# Altium project DPS-300.PrjPcb
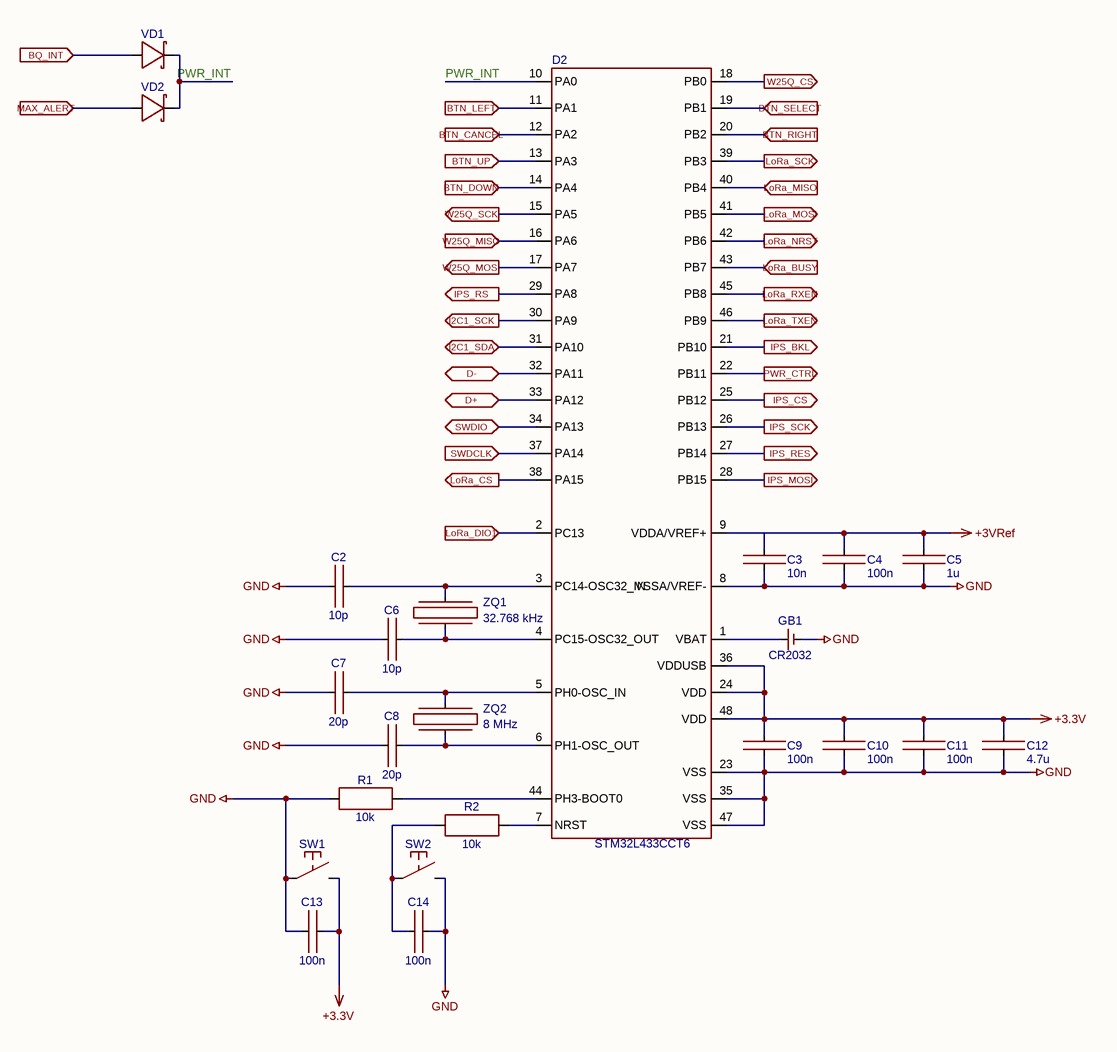
[diagram p0: MCU.SchDoc]
8 sheets, 76 parts. Net scope: flat (ports and power ports of the same name join across sheets).
Board file: DPS-300.PcbDoc
Sheets:
  MCU.SchDoc
  Power.SchDoc
  USB.SchDoc
  Connectors.SchDoc
  LoRa.SchDoc
  Display.SchDoc
  Keyboard.SchDoc
  Flash.SchDoc

## Sheet MCU.SchDoc
size A3; SheetNumber: 1; SheetTotal: 8

### Parts
C2  10p  [CAPC1608X09N]
C3  10n  [CAPC1608X09N]
C4  100n  [CAPC1608X09N]
C5  1u  [CAPC1608X09N]
C6  10p  [CAPC1608X09N]
C7  20p  [CAPC1608X09N]
C8  20p  [CAPC1608X09N]
C9  100n  [CAPC1608X09N]
C10  100n  [CAPC1608X09N]
C11  100n  [CAPC1608X09N]
C12  4.7u  [CAPC1608X09N]
C13  100n  [CAPC1608X09N]
C14  100n  [CAPC1608X09N]
D2  STM32L433CCT6  [STM LQFP-48 (5B_ME_V2)]
GB1  CR2032  [KLS5-CR2032-03]
R1  10k  [RESC2012X05N]
R2  10k  [RESC2012X05N]
SW1  FSM1SM  [FSM1SM]  (value not drawn)
SW2  FSM1SM  [FSM1SM]  (value not drawn)
VD1  BAR6402VH6327XTSA1  [INFENION SC79]  (value not drawn)
VD2  BAR6402VH6327XTSA1  [INFENION SC79]  (value not drawn)
ZQ1  32.768 kHz  [NX3215SA]
ZQ2  8 МHz  [NX5032GA]

### Ports
BQ_INT (in), BTN_CANCEL (in), BTN_DOWN (in), BTN_LEFT (in), BTN_RIGHT (in), BTN_SELECT (in), BTN_UP (in), D+ (bidir), D- (bidir), I2C1_SCK (out), I2C1_SDA (bidir), IPS_BKL (out), IPS_CS (out), IPS_MOSI (out), IPS_RES (out), IPS_RS (out), IPS_SCK (out), LoRa_BUSY (in), LoRa_CS (out), LoRa_DIO1 (in), LoRa_MISO (in), LoRa_MOSI (out), LoRa_NRST (out), LoRa_RXEN (out), LoRa_SCK (out), LoRa_TXEN (out), MAX_ALERT (in), PWR_CTRL (out), SWDCLK (in), SWDIO (bidir), W25Q_CS (out), W25Q_MISO (in), W25Q_MOSI (out), W25Q_SCK (out)

### Nets
+3.3V: C9.2 C10.2 C11.2 C12.2 C13.2 D2.24(VDD) D2.36(VDDUSB) D2.48(VDD) SW1.1
+3VRef: C3.2 C4.2 C5.2 D2.9(VDDA/VREF+)
GND: C2.1 C3.1 C4.1 C5.1 C6.1 C7.1 C8.1 C9.1 C10.1 C11.1 C12.1 C13.1 C14.2 D2.8(VSSA/VREF-) D2.23(VSS) D2.35(VSS) D2.47(VSS) GB1.0 R1.1 SW1.0 SW2.1
BQ_INT: VD1.2 ; port BQ_INT
BTN_CANCEL: D2.12(PA2) ; port BTN_CANCEL
BTN_DOWN: D2.14(PA4) ; port BTN_DOWN
BTN_LEFT: D2.11(PA1) ; port BTN_LEFT
BTN_RIGHT: D2.20(PB2) ; port BTN_RIGHT
BTN_SELECT: D2.19(PB1) ; port BTN_SELECT
BTN_UP: D2.13(PA3) ; port BTN_UP
D+: D2.33(PA12) ; port D+
D-: D2.32(PA11) ; port D-
I2C1_SCK: D2.30(PA9) ; port I2C1_SCK
I2C1_SDA: D2.31(PA10) ; port I2C1_SDA
IPS_BKL: D2.21(PB10) ; port IPS_BKL
IPS_CS: D2.25(PB12) ; port IPS_CS
IPS_MOSI: D2.28(PB15) ; port IPS_MOSI
IPS_RES: D2.27(PB14) ; port IPS_RES
IPS_RS: D2.29(PA8) ; port IPS_RS
IPS_SCK: D2.26(PB13) ; port IPS_SCK
LoRa_BUSY: D2.43(PB7) ; port LoRa_BUSY
LoRa_CS: D2.38(PA15) ; port LoRa_CS
LoRa_DIO1: D2.2(PC13) ; port LoRa_DIO1
LoRa_MISO: D2.40(PB4) ; port LoRa_MISO
LoRa_MOSI: D2.41(PB5) ; port LoRa_MOSI
LoRa_NRST: D2.42(PB6) ; port LoRa_NRST
LoRa_RXEN: D2.45(PB8) ; port LoRa_RXEN
LoRa_SCK: D2.39(PB3) ; port LoRa_SCK
LoRa_TXEN: D2.46(PB9) ; port LoRa_TXEN
MAX_ALERT: VD2.2 ; port MAX_ALERT
PWR_CTRL: D2.22(PB11) ; port PWR_CTRL
PWR_INT: D2.10(PA0) VD1.1 VD2.1
SWDCLK: D2.37(PA14) ; port SWDCLK
SWDIO: D2.34(PA13) ; port SWDIO
W25Q_CS: D2.18(PB0) ; port W25Q_CS
W25Q_MISO: D2.16(PA6) ; port W25Q_MISO
W25Q_MOSI: D2.17(PA7) ; port W25Q_MOSI
W25Q_SCK: D2.15(PA5) ; port W25Q_SCK
NetC2_2: C2.2 D2.3(PC14-OSC32_IN) ZQ1.1
NetC6_2: C6.2 D2.4(PC15-OSC32_OUT) ZQ1.0
NetC7_2: C7.2 D2.5(PH0-OSC_IN) ZQ2.1
NetC8_2: C8.2 D2.6(PH1-OSC_OUT) ZQ2.0
NetC14_1: C14.1 R2.1 SW2.0
NetD2_1: D2.1(VBAT) GB1.1
NetD2_7: D2.7(NRST) R2.2
NetD2_44: D2.44(PH3-BOOT0) R1.2

### Library data of the parts
C2 C6 = C0603-10p-50V-NPO-5%: GRM1885C1H100JA01D
C3 = C0603-10n-100V-X7R-10%: GRM188R72A103KA01D
C4 C9-C11 C13 C14 = C0603-100n-25V-X7R-10%: GRM188R71E104KA01D
C5 = C0603-1u-25V-X7R-10%: GRM188R71E105KA12D
C7 C8 = C0603-20p-50V-NPO-5%: GRM1885C1H200J
C12 = C0603-4.7u-10V-X5R-10%: GRM188R61A475K
GB1 = KLS5-CR2032-03
R1 R2 = R-0805-10k-5%
SW1 SW2 = FSM1SM: 1437566-3 (FSMSM), Кнопка тактовая h=4.6 мм SMD SPST
ZQ1 = NX3215SA: 32.768 кГц, 20ppm, 7пФ, 70кОм, -40...+85°C, SMD 3.2*1.5*0.8мм, Кварцевый резонатор
ZQ2 = NX5032GA: 8 МГц, 30/20ppm, 8пФ, -40...+85°C, SMD 5.0*3.2*1.3мм, Кварцевый резонатор

## Sheet Power.SchDoc
size A4; SheetNumber: 2; SheetTotal: 8
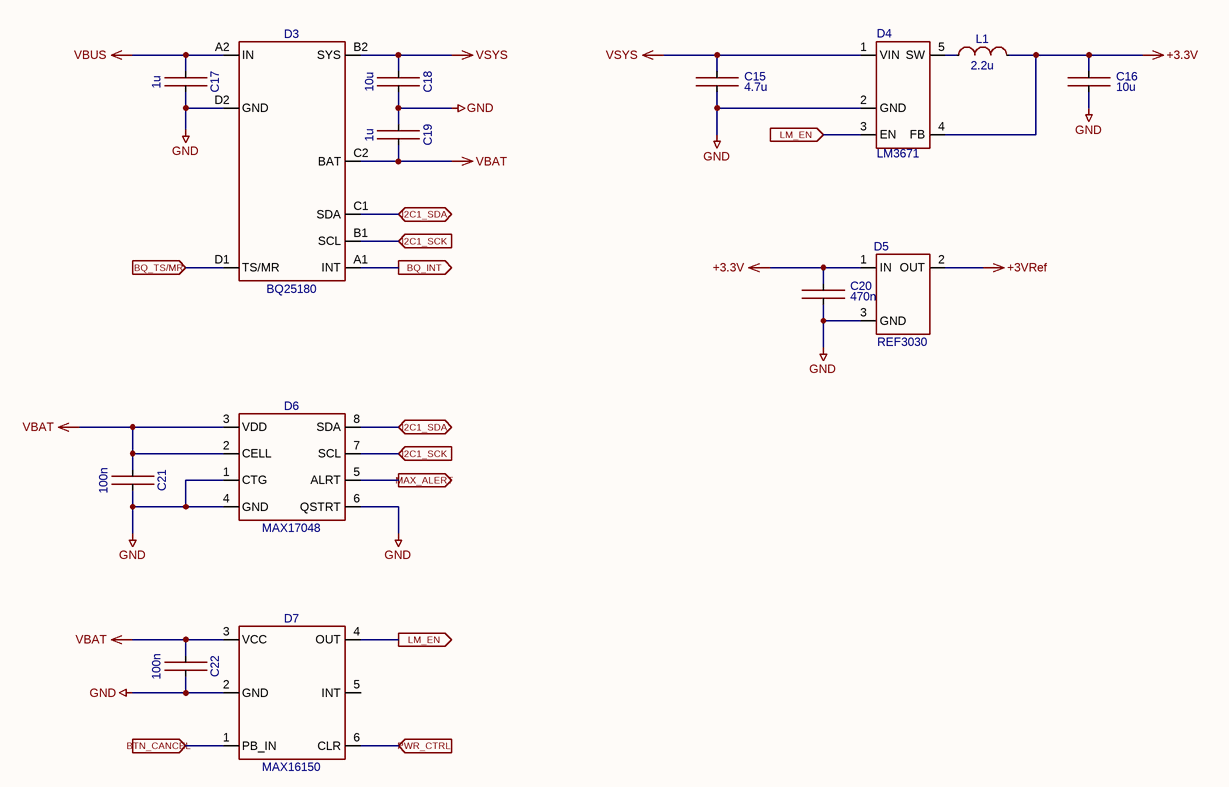
[diagram p1: Power.SchDoc]

### Parts
C15  4.7u  [CAPC1608X09N]
C16  10u  [CAPC1608X09N]
C17  1u  [CAPC1608X09N]
C18  10u  [CAPC1608X09N]
C19  1u  [CAPC1608X09N]
C20  470n  [CAPC1608X09N]
C21  100n  [CAPC1608X09N]
C22  100n  [CAPC1608X09N]
D3  BQ25180  [TI DSBGA (YBG0008)]
D4  LM3671  [TI DBV (R-PDSO-G5)]
D5  REF3030  [TI DBZ (R-PDSO-G3)]
D6  MAX17048  [MAXIM 8 TDFN-EP (T822-3)]
D7  MAX16150  [MAXIM WLP6 (21-0058)]
L1  2.2u  [Murata LQH43CN]

### Ports
BQ_INT (out), BQ_TS/MR (in), BTN_CANCEL (in), I2C1_SCK (in), I2C1_SDA (bidir), LM_EN (in), LM_EN (out), MAX_ALERT (out), PWR_CTRL (in)

### Nets
+3.3V: C16.2 C20.2 D4.4(FB) D5.1(IN) L1.2
+3VRef: D5.2(OUT)
GND: C15.1 C16.1 C17.2 C18.2 C19.1 C20.1 C21.2 C22.2 D3.D2(GND) D4.2(GND) D5.3(GND) D6.1(CTG) D6.4(GND) D6.6(QSTRT) D7.2(GND)
VBAT: C19.2 C21.1 C22.1 D3.C2(BAT) D6.2(CELL) D6.3(VDD) D7.3(VCC)
VBUS: C17.1 D3.A2(IN)
VSYS: C15.2 C18.1 D3.B2(SYS) D4.1(VIN)
BQ_INT: D3.A1(INT) ; port BQ_INT
BQ_TS/MR: D3.D1(TS/MR) ; port BQ_TS/MR
BTN_CANCEL: D7.1(PB_IN) ; port BTN_CANCEL
I2C1_SCK: D3.B1(SCL) D6.7(SCL) ; port I2C1_SCK
I2C1_SDA: D3.C1(SDA) D6.8(SDA) ; port I2C1_SDA
LM_EN: D4.3(EN) D7.4(OUT) ; port LM_EN
MAX_ALERT: D6.5(ALRT) ; port MAX_ALERT
PWR_CTRL: D7.6(CLR) ; port PWR_CTRL
NetD4_5: D4.5(SW) L1.1

Not connected (* = marked no-connect by the designer): D7 5(INT)

### Library data of the parts
C15 = C0603-4.7u-10V-X5R-10%: GRM188R61A475K
C16 C18 = C0603-10u-6.3V-X5R-20%: GRM188R60J106ME47D
C17 C19 = C0603-1u-25V-X7R-10%: GRM188R71E105KA12D
C20 = C0603-470n-16V-X7R-10%: GRM188R71C474KA88D
C21 C22 = C0603-100n-25V-X7R-10%: GRM188R71E104KA01D
D3 = BQ25180YBGR: 1-A Li-ion I²C programmable charger with regulated power path in WCSP package
D4 = LM3671MF-3.3/NOPB
D5 = REF3030AIDBZT
D6 = MAX17048G
D7 = MAX16150A
L1 = L1812-2.2u-0.9A-20%: LQH43CN2R2M03L

## Sheet USB.SchDoc
size A4; SheetNumber: 3; SheetTotal: 8
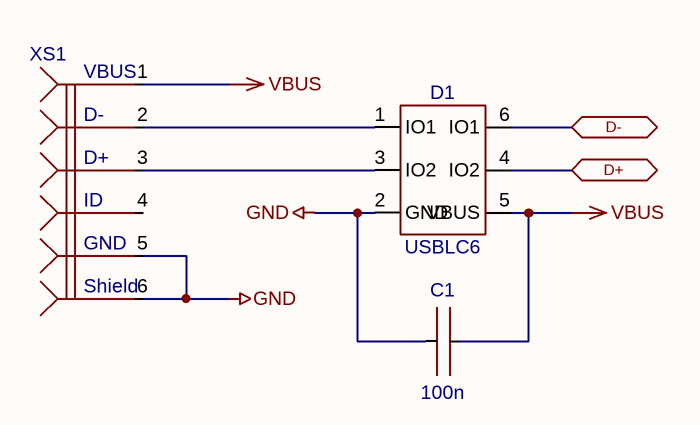
[diagram p2: USB.SchDoc]

### Parts
C1  100n  [CAPC1608X09N]
D1  USBLC6  [STM SOT23-6L]
XS1  MOLEX 1050170001  [MOLEX 1050170001]  (value not drawn)

### Ports
D+ (bidir), D- (bidir)

### Nets
GND: C1.1 D1.2(GND) XS1.5(GND) XS1.6(SHIELD)
VBUS: C1.2 D1.5(VBUS) XS1.1(VBUS)
D+: D1.4(IO2) ; port D+
D-: D1.6(IO1) ; port D-
NetD1_1: D1.1(IO1) XS1.2(D-)
NetD1_3: D1.3(IO2) XS1.3(D+)

Not connected (* = marked no-connect by the designer): XS1 4(ID)

### Notes on the sheet
- (in symbol MOLEX 1050170001) Shield

### Library data of the parts
C1 = C0603-100n-25V-X7R-10%: GRM188R71E104KA01D
D1 = USBLC6-2SC6

## Sheet Connectors.SchDoc
size A4; SheetNumber: 4; SheetTotal: 8
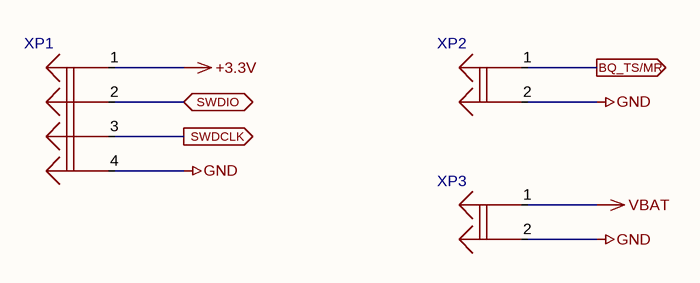
[diagram p3: Connectors.SchDoc]

### Parts
XP1  MOLEX 781710004  [MOLEX 781710004]  (value not drawn)
XP2  MOLEX 781710002  [MOLEX 781710002]  (value not drawn)
XP3  MOLEX 781710002  [MOLEX 781710002]  (value not drawn)

### Ports
BQ_TS/MR (out), SWDCLK (out), SWDIO (bidir)

### Nets
+3.3V: XP1.1
GND: XP1.4 XP2.2 XP3.2
VBAT: XP3.1
BQ_TS/MR: XP2.1 ; port BQ_TS/MR
SWDCLK: XP1.3 ; port SWDCLK
SWDIO: XP1.2 ; port SWDIO

### Library data of the parts
XP1 = MOLEX 781710004: 1.20mm Pitch, Pico-EZmate PCB Header, Single Row, Gold Plating, Friction Lock, 4 Circuits
XP2 XP3 = MOLEX 781710002: 1.20mm Pitch, Pico-EZmate PCB Header, Single Row, Gold Plating, Friction Lock, 2 Circuits

## Sheet LoRa.SchDoc
size A4; SheetNumber: 5; SheetTotal: 8
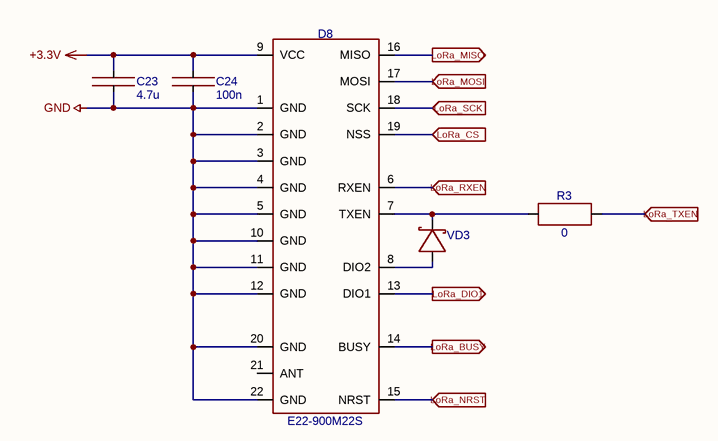
[diagram p4: LoRa.SchDoc]

### Parts
C23  4.7u  [CAPC1608X09N]
C24  100n  [CAPC1608X09N]
D8  E22-900M22S  [EBYTE E22]
R3  0  [RESC1608X05N]
VD3  BAR6402VH6327XTSA1  [INFENION SC79]  (value not drawn)

### Ports
LoRa_BUSY (out), LoRa_CS (in), LoRa_DIO1 (out), LoRa_MISO (out), LoRa_MOSI (in), LoRa_NRST (in), LoRa_RXEN (in), LoRa_SCK (in), LoRa_TXEN (in)

### Nets
+3.3V: C23.2 C24.2 D8.9(VCC)
GND: C23.1 C24.1 D8.1(GND) D8.2(GND) D8.3(GND) D8.4(GND) D8.5(GND) D8.10(GND) D8.11(GND) D8.12(GND) D8.20(GND) D8.22(GND)
LoRa_BUSY: D8.14(BUSY) ; port LoRa_BUSY
LoRa_CS: D8.19(NSS) ; port LoRa_CS
LoRa_DIO1: D8.13(DIO1) ; port LoRa_DIO1
LoRa_MISO: D8.16(MISO) ; port LoRa_MISO
LoRa_MOSI: D8.17(MOSI) ; port LoRa_MOSI
LoRa_NRST: D8.15(NRST) ; port LoRa_NRST
LoRa_RXEN: D8.6(RXEN) ; port LoRa_RXEN
LoRa_SCK: D8.18(SCK) ; port LoRa_SCK
LoRa_TXEN: R3.2 ; port LoRa_TXEN
NetD8_7: D8.7(TXEN) R3.1 VD3.1
NetD8_8: D8.8(DIO2) VD3.2

Not connected (* = marked no-connect by the designer): D8 21(ANT)

### Library data of the parts
C23 = C0603-4.7u-10V-X5R-10%: GRM188R61A475K
C24 = C0603-100n-25V-X7R-10%: GRM188R71E104KA01D
R3 = R-0603-0

## Sheet Display.SchDoc
size A4; SheetNumber: 6; SheetTotal: 8
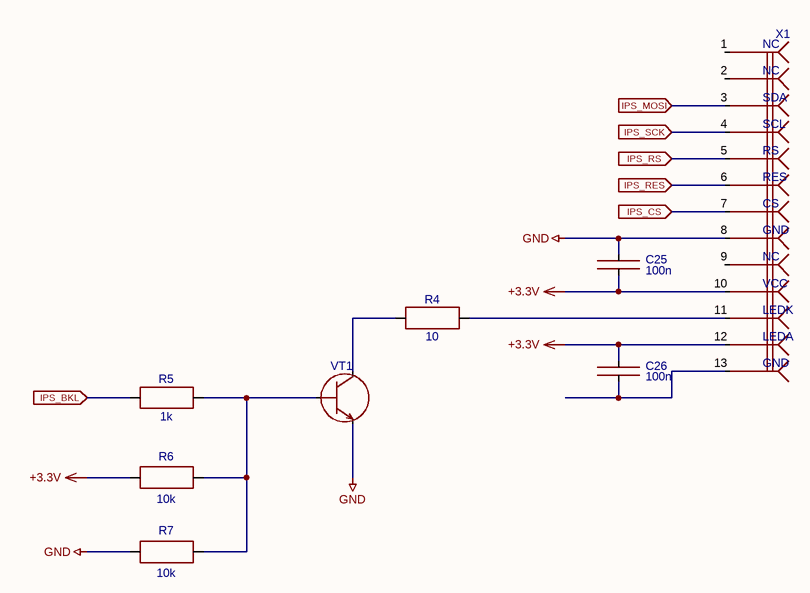
[diagram p5: Display.SchDoc]

### Parts
C25  100n  [CAPC1608X09N]
C26  100n  [CAPC1608X09N]
R4  10  [RESC2012X05N]
R5  1k  [RESC1608X05N]
R6  10k  [RESC2012X05N]
R7  10k  [RESC2012X05N]
VT1  BC817  [SOT23127P600-8N]  (value not drawn)
X1  IPC-1.14  [144-IPS]  (value not drawn)

### Ports
IPS_BKL (in), IPS_CS (in), IPS_MOSI (in), IPS_RES (in), IPS_RS (in), IPS_SCK (in)

### Nets
+3.3V: C25.1 C26.2 R6.2 X1.10(SHIELD) X1.12(SHIELD)
GND: C25.2 R7.2 VT1.E X1.8(SHIELD)
IPS_BKL: R5.1 ; port IPS_BKL
IPS_CS: X1.7(SHIELD) ; port IPS_CS
IPS_MOSI: X1.3(D+) ; port IPS_MOSI
IPS_RES: X1.6(SHIELD) ; port IPS_RES
IPS_RS: X1.5(GND) ; port IPS_RS
IPS_SCK: X1.4(ID) ; port IPS_SCK
NetC26_1: C26.1 X1.13(SHIELD)
NetR4_1: R4.1 VT1.C
NetR4_2: R4.2 X1.11(SHIELD)
NetR5_2: R5.2 R6.1 R7.1 VT1.B

Not connected (* = marked no-connect by the designer): X1 1(VBUS) 2(D-) 9(SHIELD)

### Notes on the sheet
- (in symbol IPC-1.14) NC; SDA; SCL; RS; RES; CS; VCC; LEDK; LEDA

### Library data of the parts
C25 C26 = C0603-100n-25V-X7R-10%: GRM188R71E104KA01D
R4 = R-0805-10-5%
R5 = R-0603-1k-5%
R6 R7 = R-0805-10k-5%
VT1 = BC817-16LT1G: Транзистор NPN 45В 0.5А 0.31Вт

## Sheet Keyboard.SchDoc
size A4; SheetNumber: 7; SheetTotal: 8
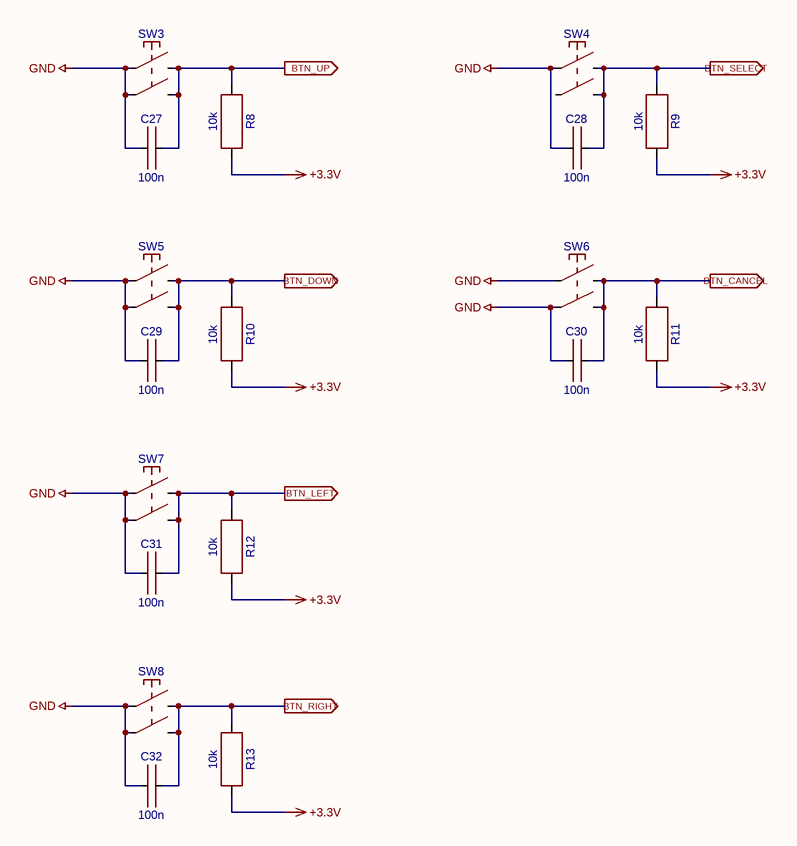
[diagram p6: Keyboard.SchDoc]

### Parts
C27  100n  [CAPC1608X09N]
C28  100n  [CAPC1608X09N]
C29  100n  [CAPC1608X09N]
C30  100n  [CAPC1608X09N]
C31  100n  [CAPC1608X09N]
C32  100n  [CAPC1608X09N]
R8  10k  [RESC2012X05N]
R9  10k  [RESC2012X05N]
R10  10k  [RESC2012X05N]
R11  10k  [RESC2012X05N]
R12  10k  [RESC2012X05N]
R13  10k  [RESC2012X05N]
SW3  KLS7-TS6601-11-180  [KLS7-TS6601-11-180]  (value not drawn)
SW4  KLS7-TS6601-11-180  [KLS7-TS6601-11-180]  (value not drawn)
SW5  KLS7-TS6601-11-180  [KLS7-TS6601-11-180]  (value not drawn)
SW6  KLS7-TS6601-11-180  [KLS7-TS6601-11-180]  (value not drawn)
SW7  KLS7-TS6601-11-180  [KLS7-TS6601-11-180]  (value not drawn)
SW8  KLS7-TS6601-11-180  [KLS7-TS6601-11-180]  (value not drawn)

### Ports
BTN_CANCEL (out), BTN_DOWN (out), BTN_LEFT (out), BTN_RIGHT (out), BTN_SELECT (out), BTN_UP (out)

### Nets
+3.3V: R8.2 R9.2 R10.2 R11.2 R12.2 R13.2
GND: C27.1 C28.1 C29.1 C30.1 C31.1 C32.1 SW3.0 SW3.2 SW4.0 SW5.0 SW5.2 SW6.0 SW6.2 SW7.0 SW7.2 SW8.0 SW8.2
BTN_CANCEL: C30.2 R11.1 SW6.1 SW6.3 ; port BTN_CANCEL
BTN_DOWN: C29.2 R10.1 SW5.1 SW5.3 ; port BTN_DOWN
BTN_LEFT: C31.2 R12.1 SW7.1 SW7.3 ; port BTN_LEFT
BTN_RIGHT: C32.2 R13.1 SW8.1 SW8.3 ; port BTN_RIGHT
BTN_SELECT: C28.2 R9.1 SW4.1 SW4.3 ; port BTN_SELECT
BTN_UP: C27.2 R8.1 SW3.1 SW3.3 ; port BTN_UP

Not connected (* = marked no-connect by the designer): SW4 2

### Library data of the parts
C27-C32 = C0603-100n-25V-X7R-10%: GRM188R71E104KA01D
R8-R13 = R-0805-10k-5%
SW3-SW8 = KLS7-TS6601-11-180: (IT-1102K) Кнопка тактовая прямая 6х6х11мм

## Sheet Flash.SchDoc
size A4; SheetNumber: 8; SheetTotal: 8
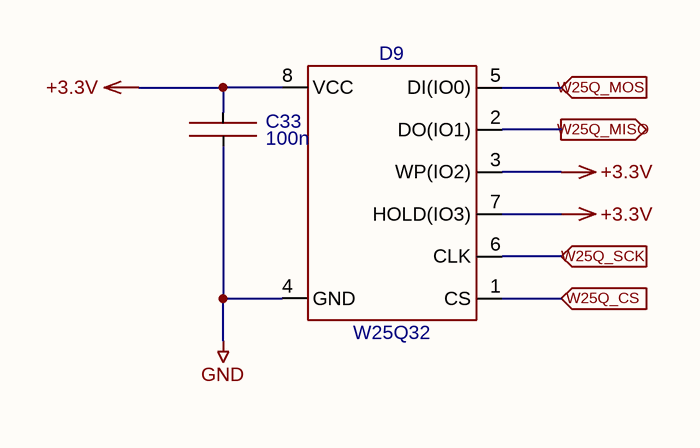
[diagram p7: Flash.SchDoc]

### Parts
C33  100n  [CAPC1608X09N]
D9  W25Q32  [WINBOND ST 8-Pin VSOP 208-mil]

### Ports
W25Q_CS (in), W25Q_MISO (out), W25Q_MOSI (in), W25Q_SCK (in)

### Nets
+3.3V: C33.2 D9.3(WP(IO2)) D9.7(HOLD(IO3)) D9.8(VCC)
GND: C33.1 D9.4(GND)
W25Q_CS: D9.1(CS) ; port W25Q_CS
W25Q_MISO: D9.2(DO(IO1)) ; port W25Q_MISO
W25Q_MOSI: D9.5(DI(IO0)) ; port W25Q_MOSI
W25Q_SCK: D9.6(CLK) ; port W25Q_SCK

### Library data of the parts
C33 = C0603-100n-25V-X7R-10%: GRM188R71E104KA01D
D9 = W25Q32BVSSIG

## Nets that join several sheets
+3.3V: MCU (9 pins), Power (5 pins), Connectors (XP1.1), LoRa (C23.2 C24.2 D8.9), Display (5 pins), Keyboard (6 pins), Flash (C33.2 D9.3 D9.7 D9.8)
+3VRef: MCU (C3.2 C4.2 C5.2 D2.9), Power (D5.2)
GND: MCU (21 pins), Power (15 pins), USB (C1.1 D1.2 XS1.5 XS1.6), Connectors (XP1.4 XP2.2 XP3.2), LoRa (12 pins), Display (C25.2 R7.2 VT1.E X1.8), Keyboard (17 pins), Flash (C33.1 D9.4)
VBAT: Power (7 pins), Connectors (XP3.1)
VBUS: Power (C17.1 D3.A2), USB (C1.2 D1.5 XS1.1)
BQ_INT: MCU (VD1.2), Power (D3.A1)
BQ_TS/MR: Power (D3.D1), Connectors (XP2.1)
BTN_CANCEL: MCU (D2.12), Power (D7.1), Keyboard (C30.2 R11.1 SW6.1 SW6.3)
BTN_DOWN: MCU (D2.14), Keyboard (C29.2 R10.1 SW5.1 SW5.3)
BTN_LEFT: MCU (D2.11), Keyboard (C31.2 R12.1 SW7.1 SW7.3)
BTN_RIGHT: MCU (D2.20), Keyboard (C32.2 R13.1 SW8.1 SW8.3)
BTN_SELECT: MCU (D2.19), Keyboard (C28.2 R9.1 SW4.1 SW4.3)
BTN_UP: MCU (D2.13), Keyboard (C27.2 R8.1 SW3.1 SW3.3)
D+: MCU (D2.33), USB (D1.4)
D-: MCU (D2.32), USB (D1.6)
I2C1_SCK: MCU (D2.30), Power (D3.B1 D6.7)
I2C1_SDA: MCU (D2.31), Power (D3.C1 D6.8)
IPS_BKL: MCU (D2.21), Display (R5.1)
IPS_CS: MCU (D2.25), Display (X1.7)
IPS_MOSI: MCU (D2.28), Display (X1.3)
IPS_RES: MCU (D2.27), Display (X1.6)
IPS_RS: MCU (D2.29), Display (X1.5)
IPS_SCK: MCU (D2.26), Display (X1.4)
LoRa_BUSY: MCU (D2.43), LoRa (D8.14)
LoRa_CS: MCU (D2.38), LoRa (D8.19)
LoRa_DIO1: MCU (D2.2), LoRa (D8.13)
LoRa_MISO: MCU (D2.40), LoRa (D8.16)
LoRa_MOSI: MCU (D2.41), LoRa (D8.17)
LoRa_NRST: MCU (D2.42), LoRa (D8.15)
LoRa_RXEN: MCU (D2.45), LoRa (D8.6)
LoRa_SCK: MCU (D2.39), LoRa (D8.18)
LoRa_TXEN: MCU (D2.46), LoRa (R3.2)
MAX_ALERT: MCU (VD2.2), Power (D6.5)
PWR_CTRL: MCU (D2.22), Power (D7.6)
SWDCLK: MCU (D2.37), Connectors (XP1.3)
SWDIO: MCU (D2.34), Connectors (XP1.2)
W25Q_CS: MCU (D2.18), Flash (D9.1)
W25Q_MISO: MCU (D2.16), Flash (D9.2)
W25Q_MOSI: MCU (D2.17), Flash (D9.5)
W25Q_SCK: MCU (D2.15), Flash (D9.6)